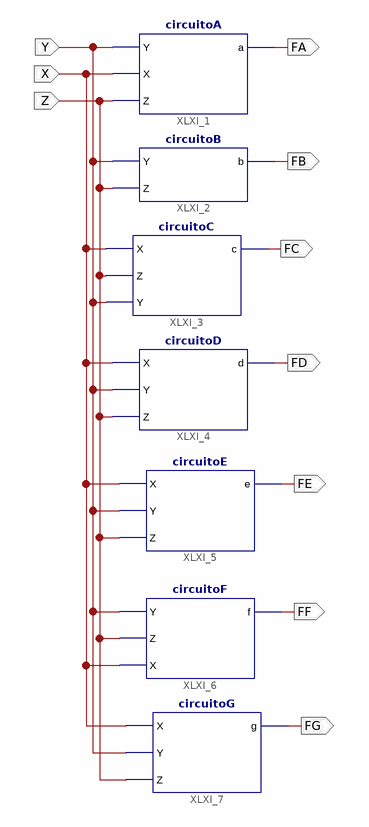
[diagram p0: schematic sheet 1]
// Xilinx ISE schematic circuitoVojabes.sch (spartan3e) as structural Verilog: 7 symbols, 10 ports
module circuitoVojabes (
  input  X,
  input  Y,
  input  Z,
  output FA,
  output FB,
  output FC,
  output FD,
  output FE,
  output FF,
  output FG
);

  circuitoA XLXI_1 (.Y(Y), .X(X), .Z(Z), .a(FA));
  circuitoB XLXI_2 (.Y(Y), .Z(Z), .b(FB));
  circuitoC XLXI_3 (.X(X), .Z(Z), .Y(Y), .c(FC));
  circuitoD XLXI_4 (.X(X), .Y(Y), .Z(Z), .d(FD));
  circuitoE XLXI_5 (.X(X), .Y(Y), .Z(Z), .e(FE));
  circuitoF XLXI_6 (.Y(Y), .Z(Z), .X(X), .f(FF));
  circuitoG XLXI_7 (.X(X), .Y(Y), .Z(Z), .g(FG));
endmodule
